# EAGLE design MPU9250_SPI (EAGLE 9.6.2)
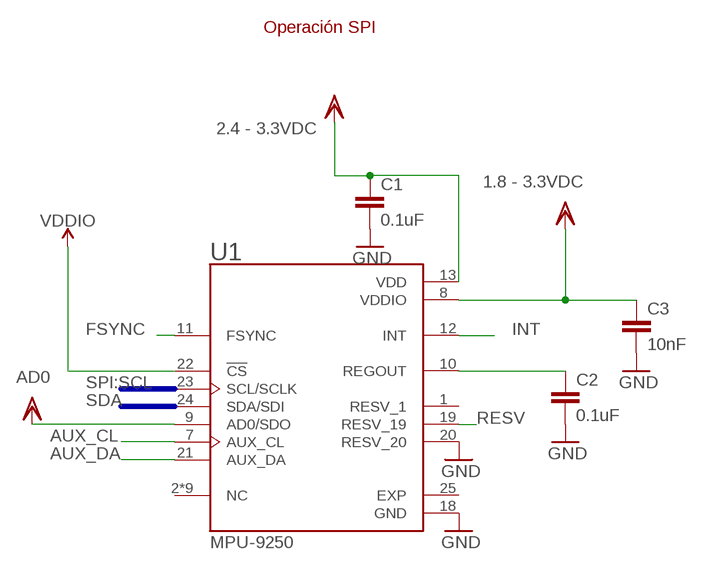
[diagram p0: schematic, sheet 1]

## Parts
C1  0.1uF  1.0NF/1000PF-1206-2KV-10%  [1206]
C2  0.1uF  1.0NF/1000PF-1206-2KV-10%  [1206]
C3  10nF  1.0NF/1000PF-1206-2KV-10%  [1206]
U1  MPU-9250  [QFN40P300X300X105-25N]

## Nets
AUX_CL: U1.7(AUX_CL)
AUX_DA: U1.21(AUX_DA)
FSYNC: U1.11(FSYNC)
GND: C1.2 C2.2 C3.2 U1.18(GND) U1.20(RESV_20)
INT: U1.12(INT)
N$2: C2.1 U1.10(REGOUT)
RESV: U1.19(RESV_19)
VDD: C1.1 C3.1 U1.8(VDDIO) U1.9(AD0/SDO) U1.13(VDD) ; supply symbol labelled 2.4 - 3.3VDC, 1.8 - 3.3VDC, AD0
VDDIO: U1.22(!CS)
Unconnected: U1.2(NC) U1.3(NC) U1.4(NC) U1.5(NC) U1.6(NC) U1.14(NC) U1.15(NC) U1.16(NC) U1.17(NC) U1.23(SCL/SCLK) U1.24(SDA/SDI) U1.25(EXP)

## Buses
SPI:SCL
SDA

## Notes on the sheet
- Operación SPI

## Power pins joined to a net without a drawn wire
RESV_1: U1.1(RESV_1)

## Library data of the parts
C1-C3 = SparkFun-Capacitors:1.0NF/1000PF: 1nF/1,000pF ceramic capacitors A capacitor is a passive two-terminal electrical component used to store electrical energy temporarily in an electric field.; PROD_ID: CAP-16238; VALUE: 1nF
U1 = MPU-9250:MPU-9250: Check availability <https://pricing.snapeda.com/parts/MPU-9250/TDK%20InvenSense/view-part?ref=eda>; AVAILABILITY: In Stock; CHECK_PRICES: https://www.snapeda.com/parts/MPU-9250/TDK/view-part/?ref=eda; DESCRIPTION: MPU-9250 series Accelerometer, Gyroscope, Humidity, Magnetometer, Pressure, Temperature Sensor Evaluation Board; MF: TDK InvenSense; MP: MPU-9250; PACKAGE: TFQFN-24 TDK InvenSense; PRICE: None; SNAPEDA_LINK: https://www.snapeda.com/parts/MPU-9250/TDK/view-part/?ref=snap

## Board
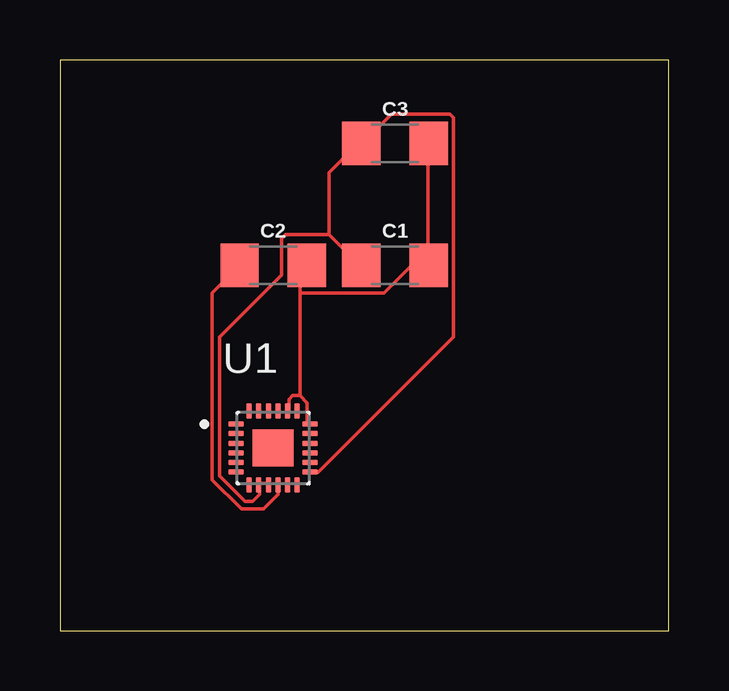
[diagram p1: board, top side]

Size 25.38 x 23.8 mm. Coordinates in mm from the lower left corner, seen from the top.
Outline: 0,0 25.38,0 25.38,23.8 0,23.8 0,0
Copper layers (1*16): Top 0.035mm / dielectric 1.5mm / Bottom 0.035mm
Design rules "default": minimum track width 6mil, minimum drill 0.35mm, track to track 6mil, track to pad 6mil, pad to pad 6mil, via to via 6mil, smd to smd 6mil, copper to edge 40mil, drill to drill 6mil, minimum pad ring 10mil, minimum via ring 8mil, stop-mask expansion 4mil, vias tented up to drill 0mil, thermal gap 10mil

### Footprints (pad centres in the part's own frame; a part is rotated, then mirrored left to right if it is on the bottom)
1206 = smd 1.6 x 1.8: 1 -1.4,0; 2 1.4,0
QFN40P300X300X105-25N = smd 0.64 x 0.22: 1 -1.545,1; 2 -1.545,0.6; 3 -1.545,0.2; 4 -1.545,-0.2; 5 -1.545,-0.6; 6 -1.545,-1; 13 1.545,-1; 14 1.545,-0.6; 15 1.545,-0.2; 16 1.545,0.2; 17 1.545,0.6; 18 1.545,1 | smd 0.22 x 0.64: 7 -1,-1.545; 8 -0.6,-1.545; 9 -0.2,-1.545; 10 0.2,-1.545; 11 0.6,-1.545; 12 1,-1.545; 19 1,1.545; 20 0.6,1.545; 21 0.2,1.545; 22 -0.2,1.545; 23 -0.6,1.545; 24 -1,1.545 | smd 1.7 x 1.54: 25 0,0

### Placement (x,y rotation side)
C1  13.97,15.24 0 top
C2  8.89,15.24 0 top
C3  13.97,20.32 0 top
U1  8.89,7.62 0 top

### Tracks (layer width: path | path; a pad name or v marks a point on that pad's centre or on a via)
GND
  Top 0.152: C3.2 15.34,20.32 15.34,15.29 C1.2 15.34,15.14 14.58,15.14 13.51,14.07 10.01,14.07 | 10.01,9.8 10.31,9.5 10.31,8.59 U1.18 | 10.01,9.8 9.7,9.8 9.55,9.65 9.55,9.2 U1.20 | 10.01,14.07 10.01,14.99 10.16,15.14 C2.2 | 10.01,14.07 10.01,9.8
N$2
  Top 0.152: U1.10 9.09,5.99 9.09,5.69 8.48,5.08 7.57,5.08 6.35,6.3 6.35,14.07 7.42,15.14 C2.1
VDD
  Top 0.152: U1.9 8.64,6.15 8.33,6.15 U1.8 8.33,5.99 8.33,5.69 8.03,5.38 7.72,5.38 6.66,6.45 6.66,12.24 9.25,14.83 9.25,16.36 9.4,16.51 11.23,16.51 | 11.23,16.51 12.45,15.29 C1.1 | U1.13 10.46,6.6 10.77,6.6 16.41,12.24 16.41,21.39 16.26,21.54 13.82,21.54 12.6,20.32 C3.1 12.45,20.32 11.23,19.1 11.23,16.51